# EasyEDA Pro project ProProject_NANO转舵机控制板.epro

# Schematic Schematic1
Create Date: 2024-08-21; Page Name: P1; Project Name: NANO转舵机控制板; Schematic Name: Schematic1; Update Date: 2024-08-21; Company: 嘉立创EDA; Page Size: A4; Version: V1.0
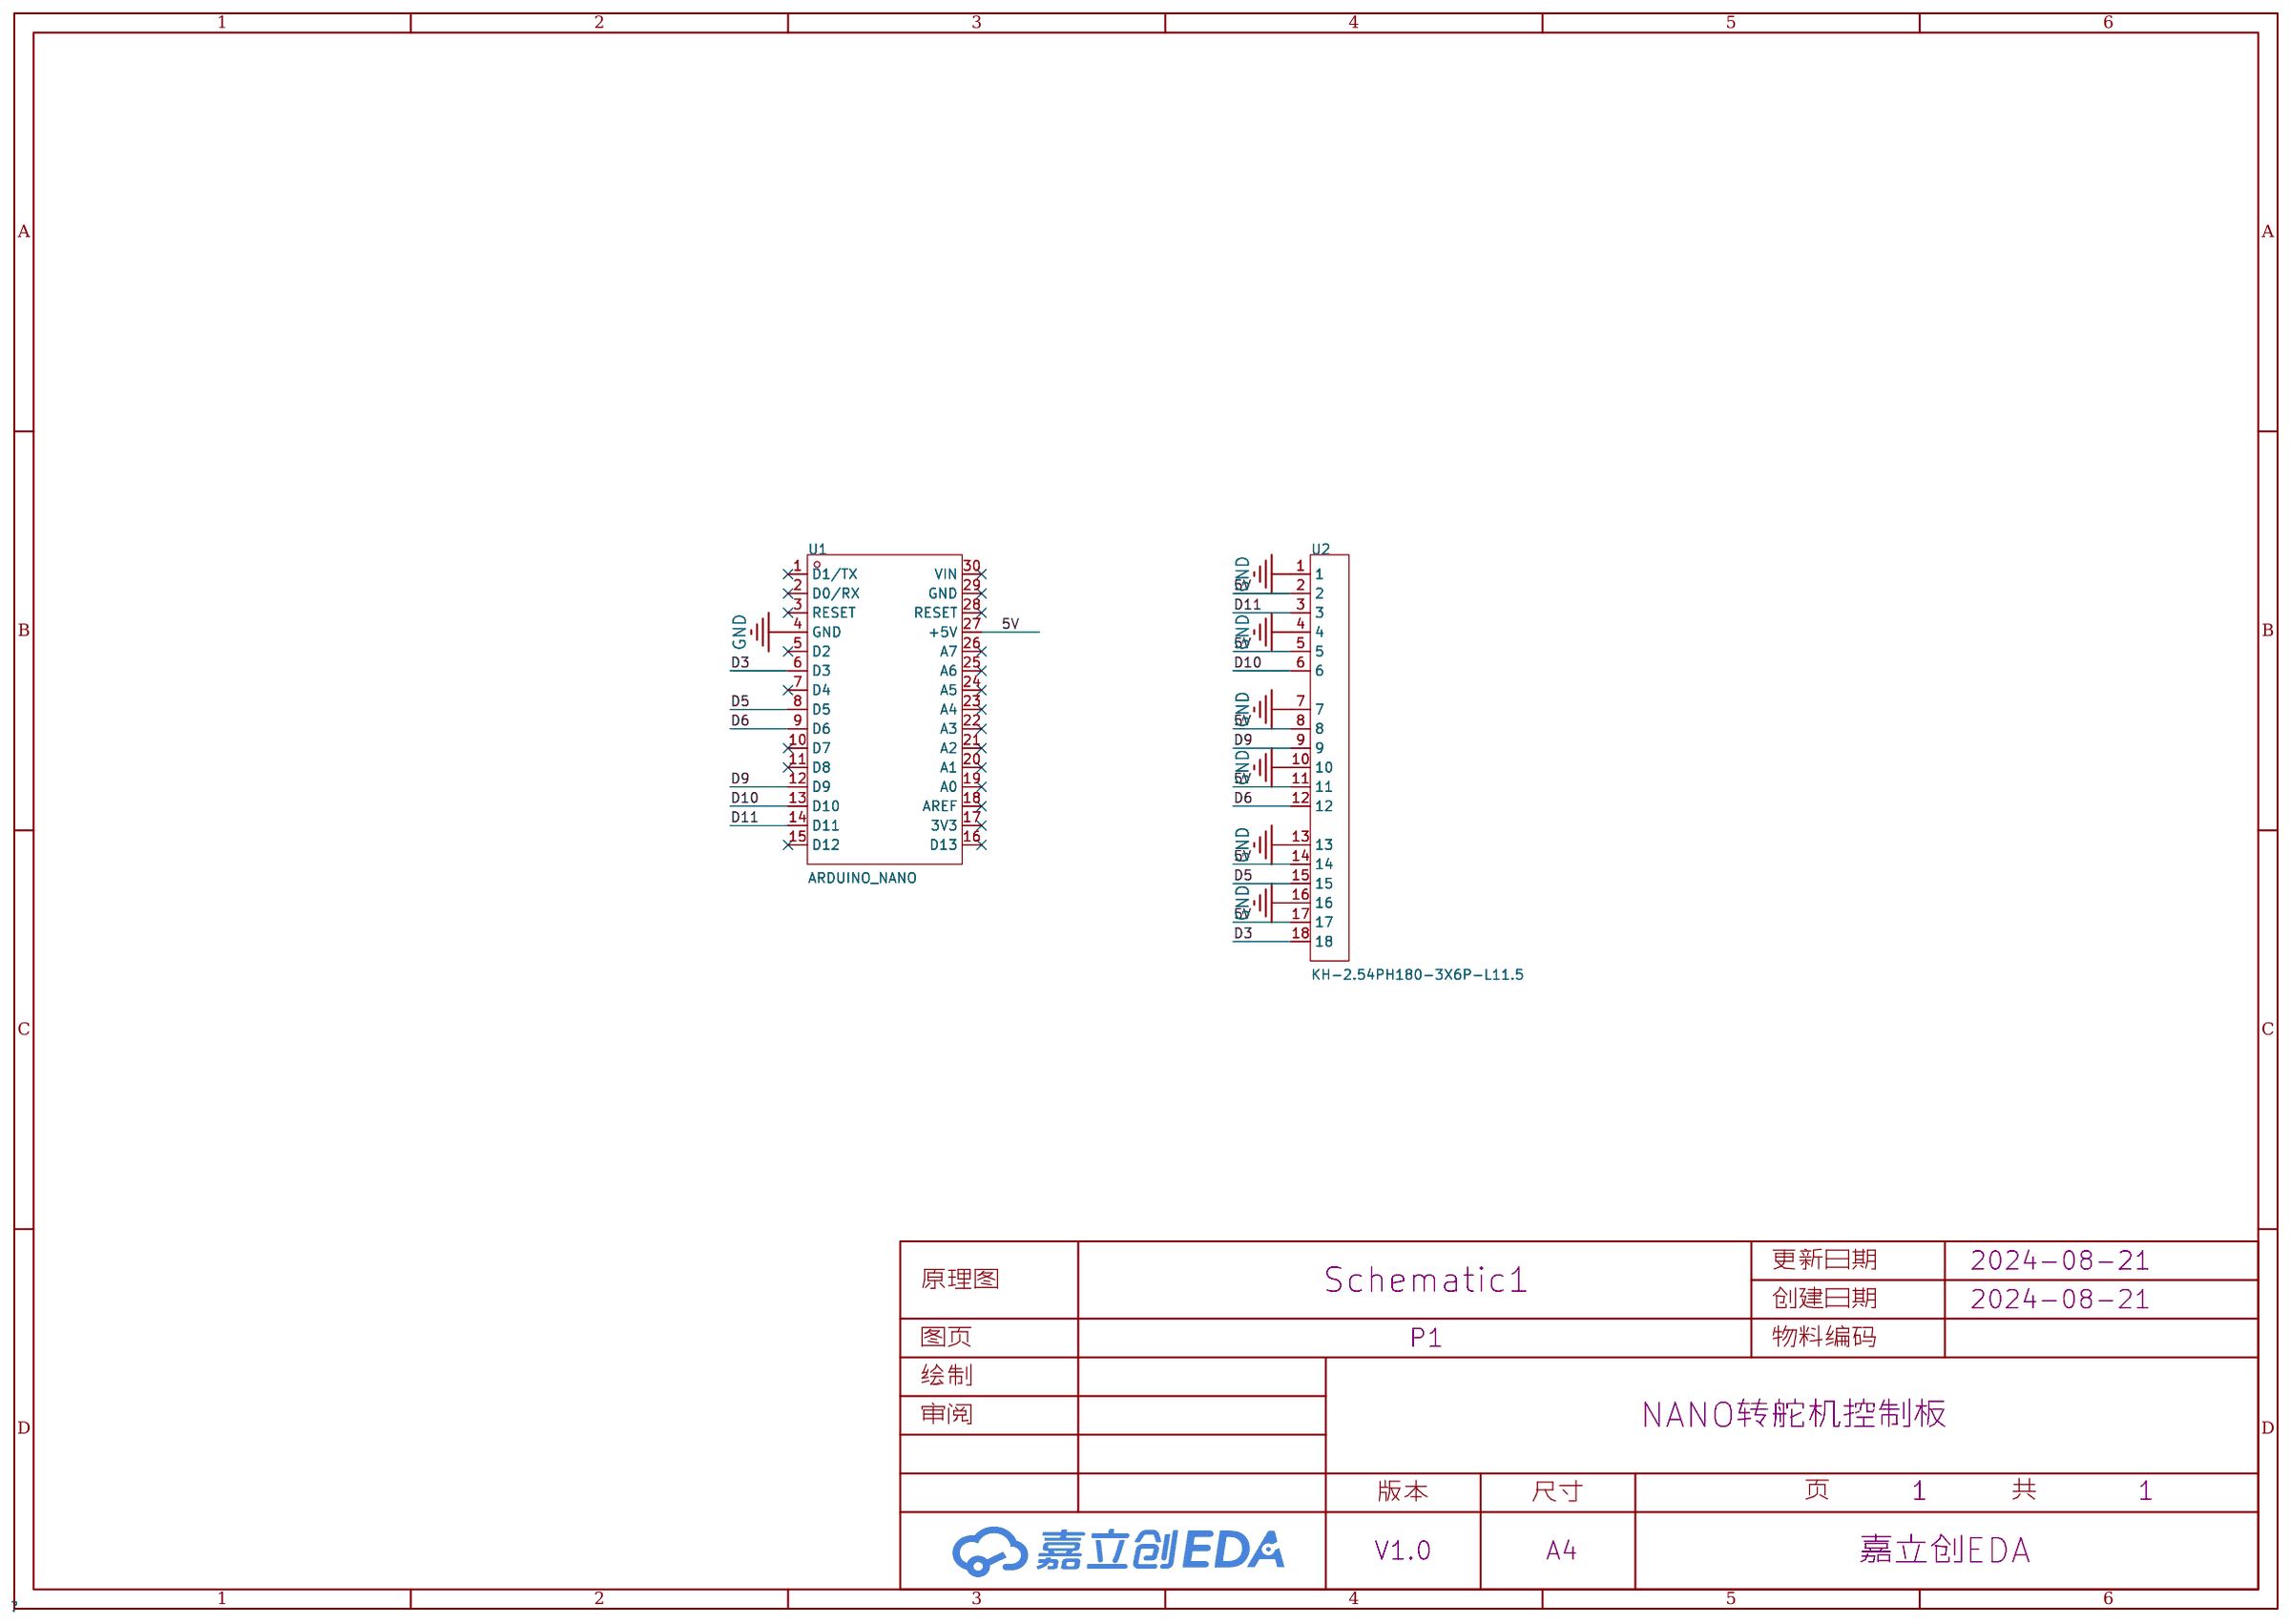
[diagram p0: schematic sheet]

## Parts
U1  ARDUINO_NANO  [COMM-TH_ARDUINO_NANO]
U2  KH-2.54PH180-3X6P-L11.5  [HDR-TH_18P-P2.54-V-M-R3-C6-S5.08]

## Library data of the parts
U1 = ARDUINO_NANO: Supplier Part: C9900017879; Supplier Footprint: 插件; JLCPCB Part Class: 扩展库; Supplier: LCSC
U2 = KH-2.54PH180-3X6P-L11.5: 插针结构:3x6P;间距:2.54mm;排数:三排;; LCSC Part Name: 3x6P 间距:2.54mm; Supplier Part: C20610253; Manufacturer: kinghelm(金航标); Supplier Footprint: 插件,P=2.54mm; JLCPCB Part Class: 扩展库; Datasheet: https://atta.szlcsc.com/upload/public/pdf/source/20240117/CF88060F379DB0CC1BA3EC74D0FDFF6E.pdf; Supplier: LCSC; Pin Structure: 3x6P; Pitch: 2.54mm; Number of Rows: 三排

## Nets
5V: U1.27(+5V) U2.2 U2.5 U2.8 U2.11 U2.14 U2.17
GND: U1.4(GND) U2.1 U2.4 U2.7 U2.10 U2.13 U2.16
D3: U1.6(D3) U2.18
D5: U1.8(D5) U2.15
D6: U1.9(D6) U2.12
D9: U1.12(D9) U2.9
D10: U1.13(D10) U2.6
D11: U1.14(D11) U2.3

Not connected (* = marked no-connect by the designer): U1 1(D1/TX)* 2(D0/RX)* 3(RESET)* 5(D2)* 7(D4)* 10(D7)* 11(D8)* 15(D12)* 16(D13)* 17(3V3)* 18(AREF)* 19(A0)* 20(A1)* 21(A2)* 22(A3)* 23(A4)* 24(A5)* 25(A6)* 26(A7)* 28(RESET)* 29(GND)* 30(VIN)*

# Board PCB1
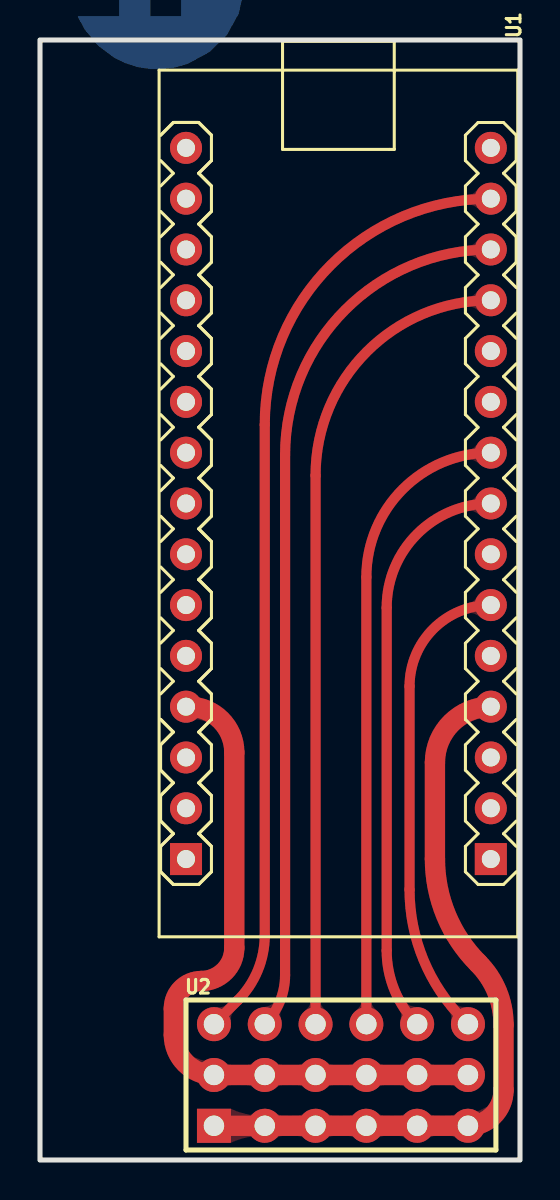
[diagram p1: board, top side]
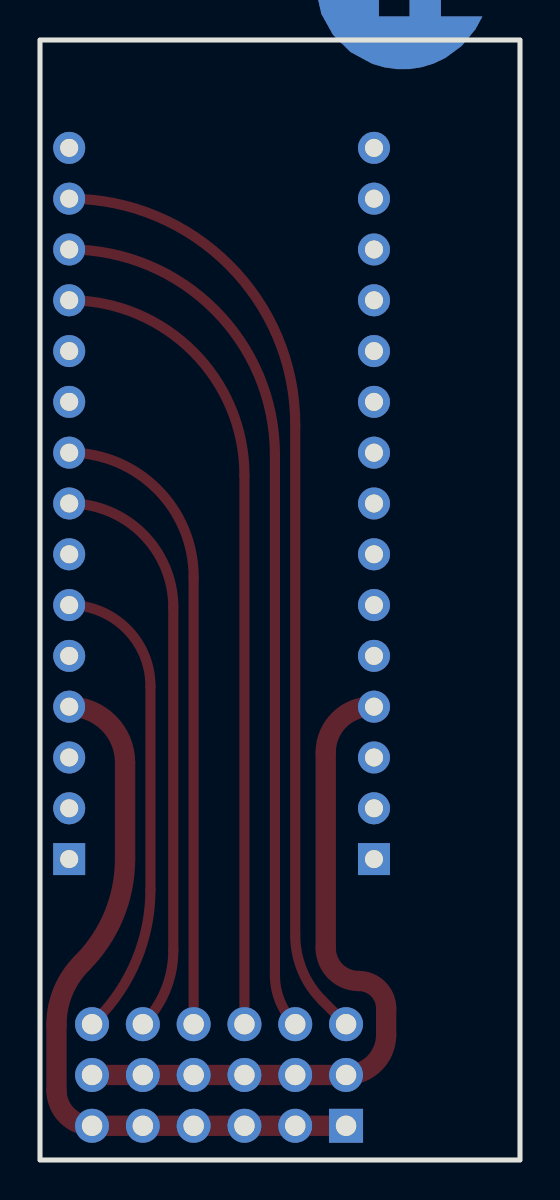
[diagram p2: board, bottom side, seen from below]

Outline 24 x 56 mm; copper layers: Top Layer, Bottom Layer. Coordinates in mm from the lower left corner of the outline.
Outline path: rectangle 0,56 24,0
Stack: Top Layer 0.035mm / Dielectric1 1.51mm FR4 er 4.5 / Bottom Layer 0.035mm

## Design rules (mm)
template: JLCPCB Capability(Two Layers Board)
spacing copperThickness1oz (default): track to track 0.102, other pairs 0.152 to 0.3
spacing copperThickness2oz: track to track 0.203, other pairs 0.152 to 0.3
track width copperThickness1oz (default): min 0.127, default 0.254, max 2.54
track width copperThickness2oz: min 0.203, default 0.254, max 2.54
differential pair differentialPair (default): width min 0.127, default 0.254, max 2.54; gap min 0.152, default 0.152
via viaSize (default): diameter min 0.5, default 0.61, max 10; hole min 0.3, default 0.305, max 6.3

## Placement (name value [footprint] x y rotation side)
U1  ARDUINO_NANO  [COMM-TH_ARDUINO_NANO]  14.92 32.83 270 top
U2  KH-2.54PH180-3X6P-L11.5  [HDR-TH_18P-P2.54-V-M-R3-C6-S5.08]  15.05 4.25 0 top

## Footprints (pads in the part's own frame, mm; a bottom-side part is the same pattern mirrored in y, then rotated)
COMM-TH_ARDUINO_NANO
  rect 1.6x1.6 hole 0.9: 1(17.78,7.62) 30(17.78,-7.62)
  round 1.6 hole 0.9: 2(15.24,7.62) 3(12.7,7.62) 4(10.16,7.62) 5(7.62,7.62) 6(5.08,7.62) 7(2.54,7.62) 8(0,7.62) 9(-2.54,7.62) 10(-5.08,7.62) 11(-7.62,7.62) 12(-10.16,7.62) 13(-12.7,7.62) 14(-15.24,7.62) 15(-17.78,7.62) 16(-17.78,-7.62) 17(-15.24,-7.62) 18(-12.7,-7.62) 19(-10.16,-7.62) 20(-7.62,-7.62) 21(-5.08,-7.62) 22(-2.54,-7.62) 23(0,-7.62) 24(2.54,-7.62) 25(5.08,-7.62) 26(7.62,-7.62) 27(10.16,-7.62) 28(12.7,-7.62) 29(15.24,-7.62)
HDR-TH_18P-P2.54-V-M-R3-C6-S5.08
  rect 1.7x1.7 hole 1.02: 1(-6.35,-2.54)
  round 1.7 hole 1.02: 2(-6.35,0) 3(-6.35,2.54) 4(-3.81,-2.54) 5(-3.81,0) 6(-3.81,2.54) 7(-1.27,-2.54) 8(-1.27,0) 9(-1.27,2.54) 10(1.27,-2.54) 11(1.27,0) 12(1.27,2.54) 13(3.81,-2.54) 14(3.81,0) 15(3.81,2.54) 16(6.35,-2.54) 17(6.35,0) 18(6.35,2.54)

## Nets
As in the schematic.

Pads without a net: U1 1 2 3 5 7 10 11 15 16 17 18 19 20 21 22 23 24 25 26 28 29 30

## Routing (per net, layer and track width the routed paths; a pad name or vN(x,y) marks a point on that pad's centre or on a via; arc(x,y) is an arc through that point)
5V: length 35.4
  Top Layer w1.016: U1.27 7.43,22.67 arc(9.04,22) 9.71,20.38 9.71,10.6 arc(9.23,9.43) 8.06,8.95 arc(7.09,8.55) 6.69,7.58 6.69,6.26 arc(7.28,4.84) U2.2 U2.5 U2.8 U2.11 U2.14 U2.17
GND: length 37.2
  Top Layer w1.016: U2.1 U2.4 U2.7 U2.10 U2.13 U2.16 arc(22.66,2.23) 23.18,3.49 23.18,6.77 arc(22.85,8.43) 21.91,9.84 arc(20.31,12.23) 19.75,15.05 19.75,19.87 arc(20.57,21.85) U1.4
D3: length 24.1
  Top Layer w0.508: U2.18 21.17,7.02 arc(19.18,10) 18.48,13.52 18.48,23.68 arc(19.67,26.56) U1.6
D5: length 29.4
  Top Layer w0.508: U1.8 arc(18.86,31.3) 17.33,27.62 17.33,10.47 arc(17.73,8.48) U2.15
D6: length 32.1
  Top Layer w0.508: U2.12 16.32,29.14 arc(18.14,33.54) U1.9
D9: length 41.2
  Top Layer w0.508: U2.9 13.78,34.22 arc(16.34,40.42) U1.12
D10: length 44.9
  Top Layer w0.508: U1.13 arc(15.27,42.51) 12.25,35.24 12.25,9.24 arc(11.99,7.92) U2.6
D11: length 48.6
  Top Layer w0.508: U2.3 9.89,7.98 arc(10.89,9.48) 11.24,11.24 11.24,36.76 arc(14.55,44.76) U1.14

Small or netless copper shapes (teardrops, artwork), in the pictures only: 35 on Bottom Layer, 36 on Top Layer
